# EasyEDA schematic SCH_Volvo CEM-L (50) cracker_2023-01-16.json

## Sheets
1 Sheet_1: TITLE: Volvo CEM cracker (P1 + P2); REV: 1.2; Date: 2021-Jan-9; Sheet: 1/1; Drawn By: vtl; Company: Kitchen office
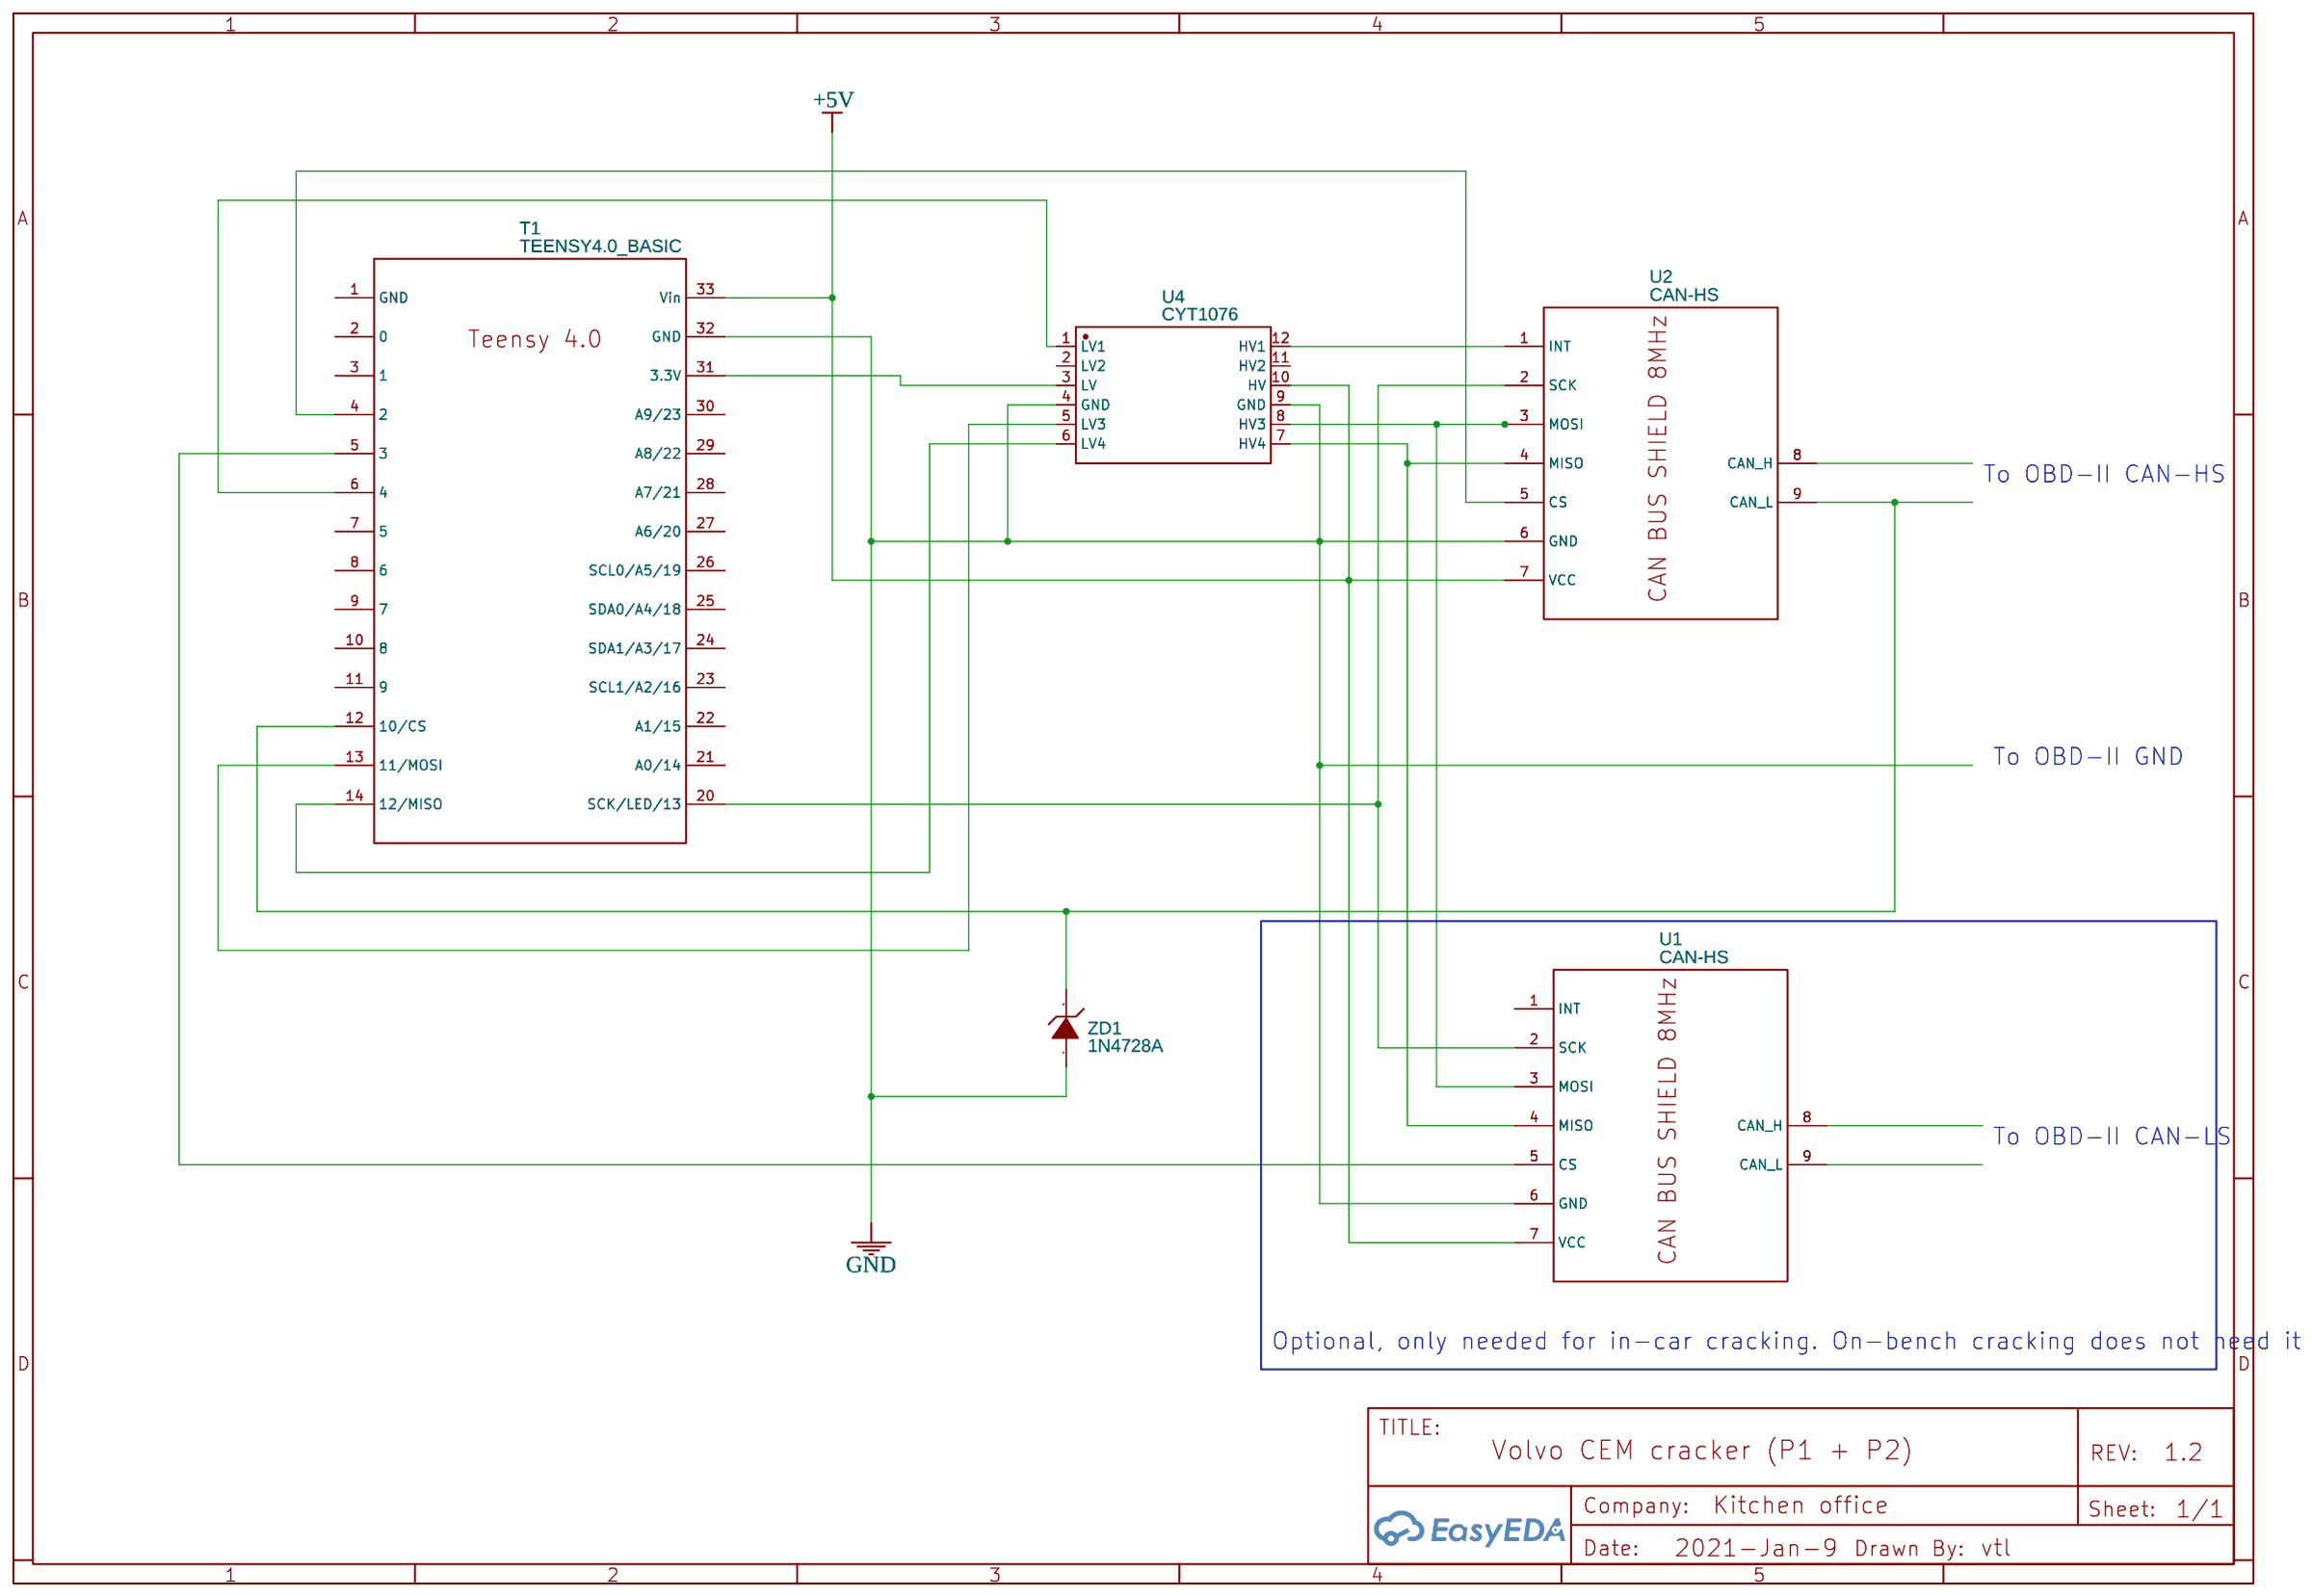
[diagram p0: Sheet_1]
2 Sheet_2: TITLE: Volvo CEM cracker (P1, P2, P3); REV: 2.01; Date: 2022-01-09
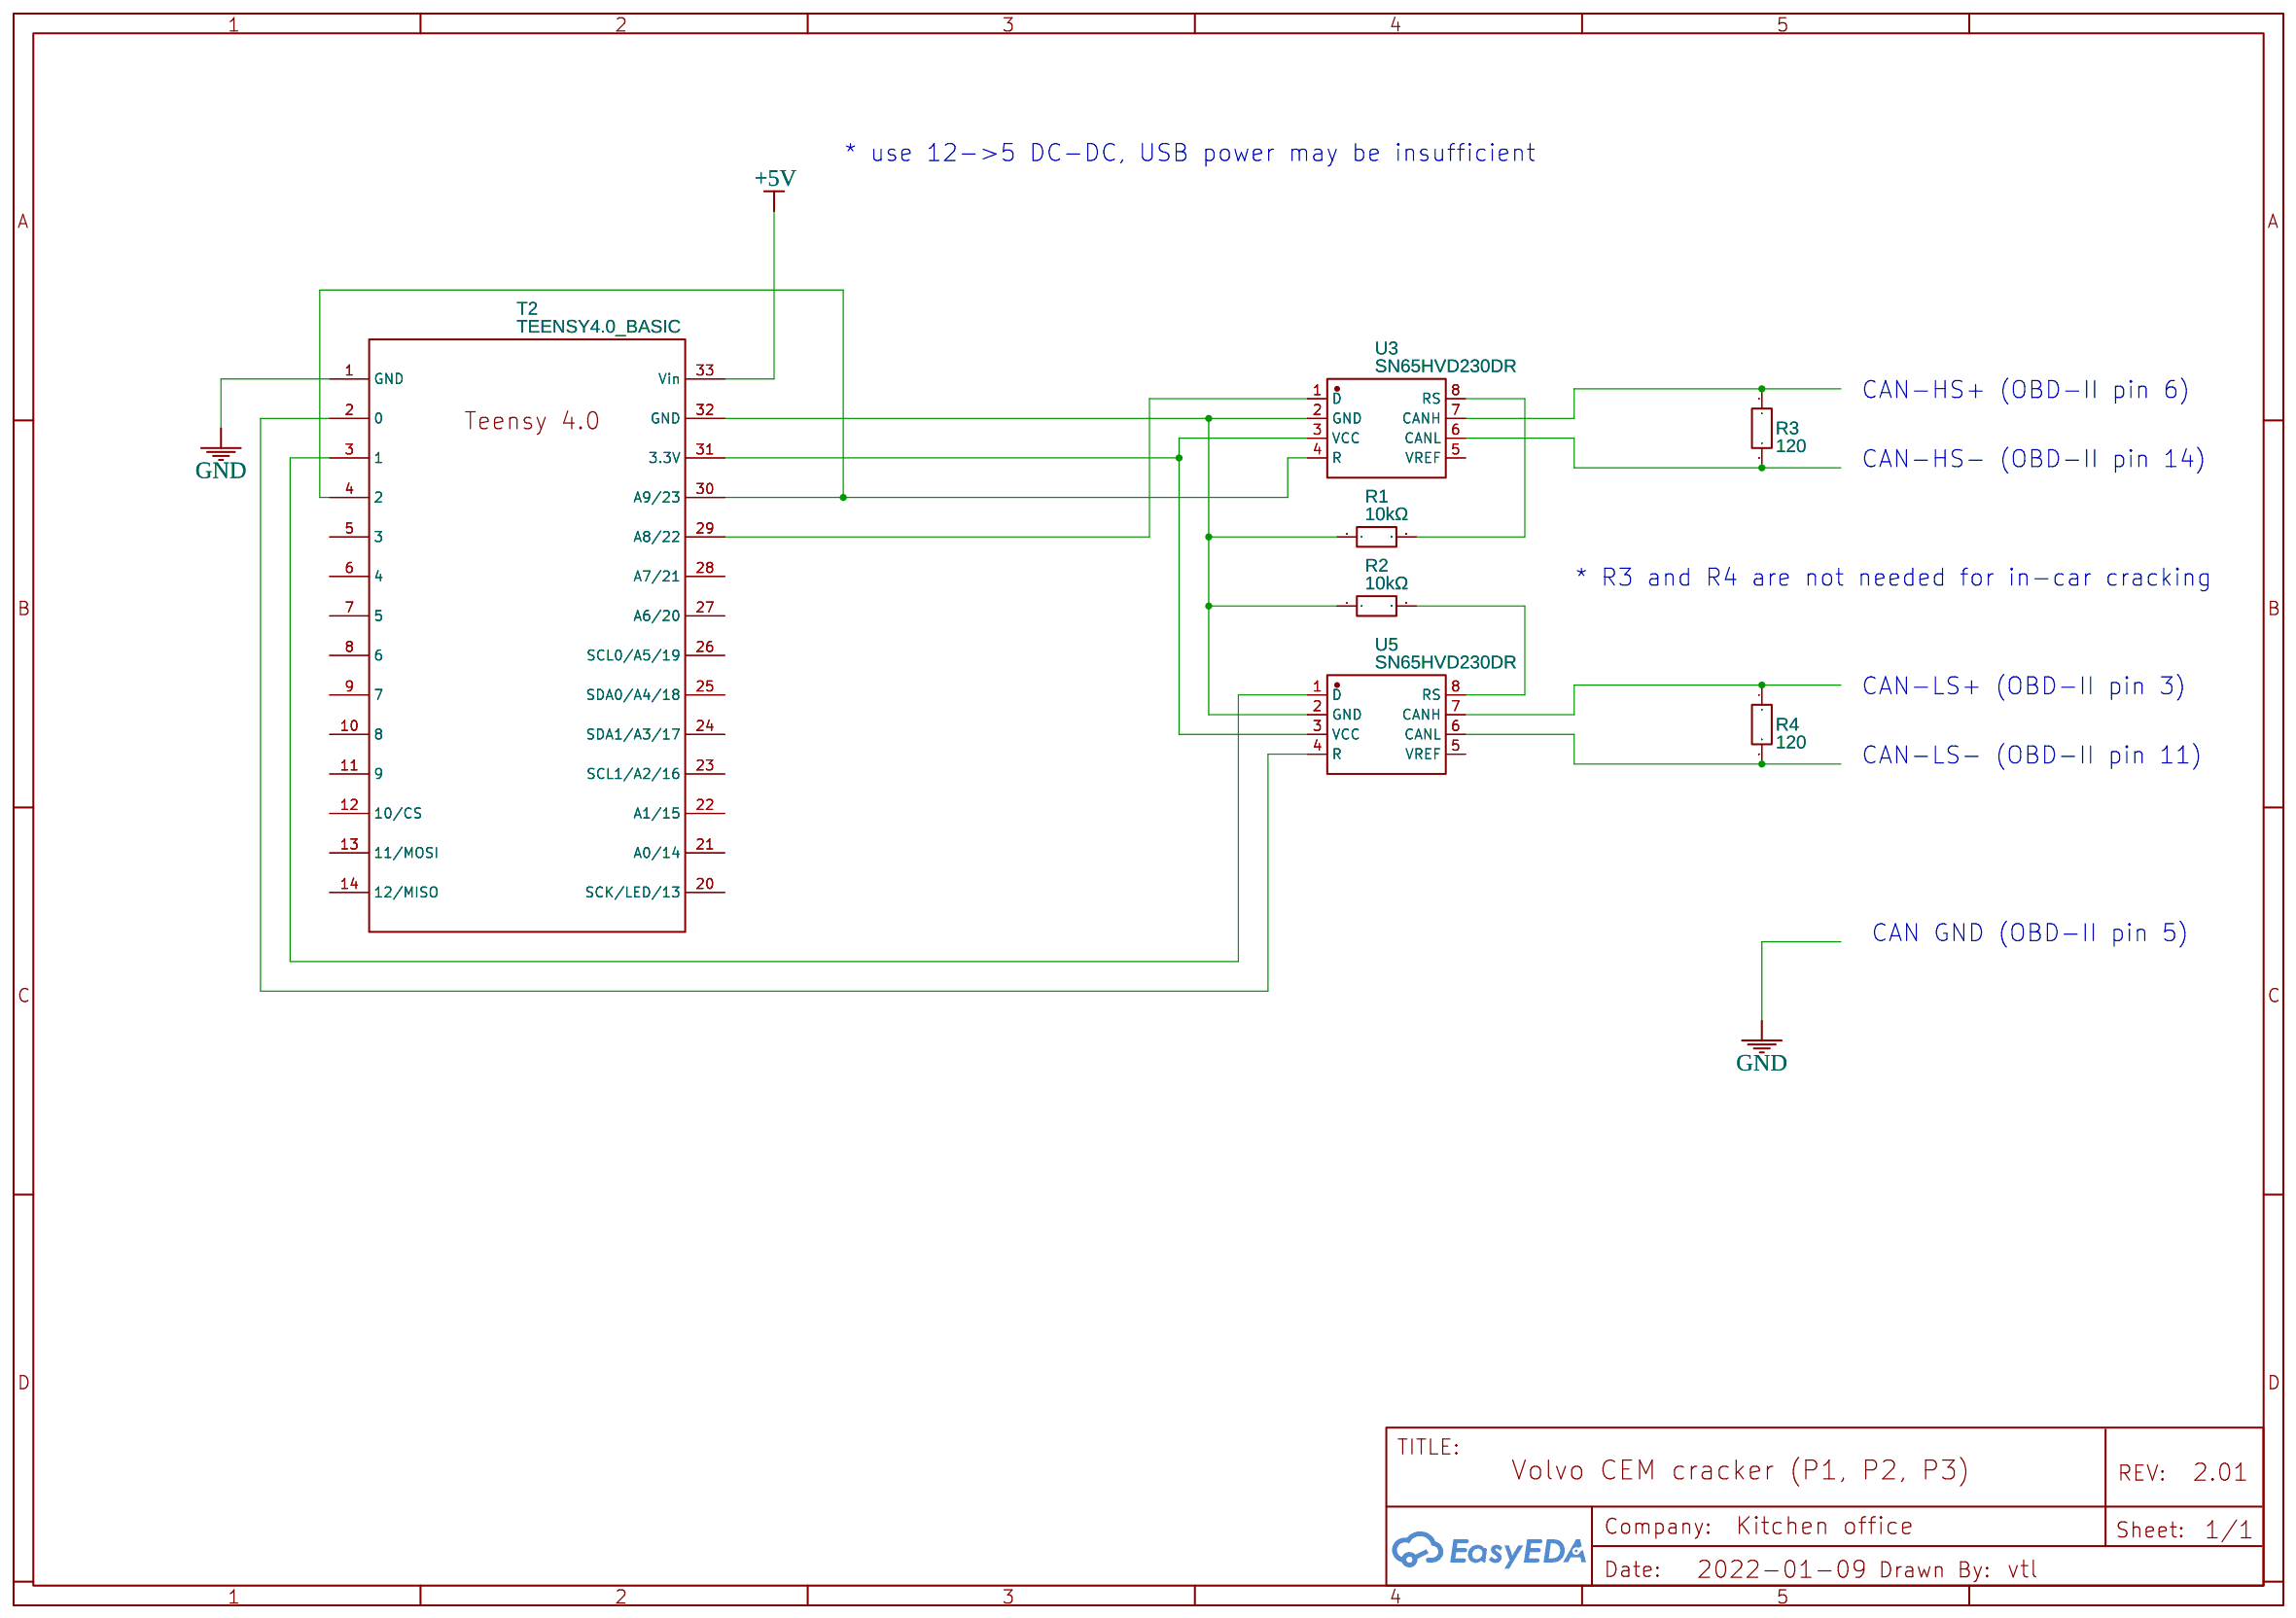
[diagram p1: Sheet_2]

## Parts
sheet Sheet_1
T1  TEENSY4.0_BASIC  [TEENSY4.0_BASIC]
U1  CAN-HS  [CAN_BUS_SHIELD_8MHZ]
U2  CAN-HS  [CAN_BUS_SHIELD_8MHZ]
U4  CYT1076  [CYT1076 FOOT]
ZD1  1N4728A  [DO-41_BD2.8-L4.2-P8.00-D0.7-FD]
sheet Sheet_2
R1  10kΩ  [RES-TH_BD1.8-L3.2-P7.20-D0.4]
R2  10kΩ  [RES-TH_BD1.8-L3.2-P7.20-D0.4]
R3  120  [RES-TH_BD5.0-L15.5-P19.50-D0.7]
R4  120  [RES-TH_BD5.0-L15.5-P19.50-D0.7]
T2  TEENSY4.0_BASIC  [TEENSY4.0_BASIC]
U3  SN65HVD230DR  [SOIC-8_L4.9-W3.9-P1.27-LS6.0-BL]
U5  SN65HVD230DR  [SOIC-8_L4.9-W3.9-P1.27-LS6.0-BL]

## Library data of the parts
T1 T2 = TEENSY4.0_BASIC: Manufacturer: PJRC; Supplier: PJRC; link: https://www.pjrc.com/store/teensy40.html; Contributor: Chris Gscheidle
U1 U2 = -: Contributor: Christer_A
U4 = -: Contributor: krzryz
ZD1 = 1N4728A: Supplier: LCSC; Manufacturer: SEMTECH; image: //image.lceda.cn/szlcsc/C2531.jpg; Supplier Part: C2531; LCSC Assembly: Yes; SMT Type: Extend
R1 R2 = CF1/6W-10KΩ±5%T52: Supplier: LCSC; Supplier Part: C714232; Manufacturer: Huaxing Mechanical-Elec.; Contributor: LCSC
R3 R4 = RD 3WS 120R J T/B A1: Supplier: LCSC; Supplier Part: C433818; Manufacturer: TyoHM; Contributor: LCSC; LCSC Assembly: Yes; SMT Type: Extend; Assembly Type: manualWeld; Paste Type: expand
U3 U5 = SN65HVD230DR: Supplier: LCSC; Manufacturer: TI; image: //image.lceda.cn/szlcsc/C12084.jpg; Supplier Part: C12084; SMT Type: Basic; JLCPCB SMD: Yes; LCSC Assembly: Yes; Assembly Type: smtWeld; Paste Type: base

## Nets
+5V: T1.33(Vin) T2.33(Vin) U1.7(VCC) U2.7(VCC) U4.10(HV)
GND: T1.32(GND) T2.1(GND) U1.6(GND) U2.6(GND) U4.4(GND) U4.9(GND) ZD1.1(A)
Net-(R1-1): R1.1 R2.1 T2.32(GND) U3.2(GND) U5.2(GND)
Net-(R1-2): R1.2 U3.8(RS)
Net-(R2-2): R2.2 U5.8(RS)
Net-(R3-1): R3.1 U3.7(CANH)
Net-(R3-2): R3.2 U3.6(CANL)
Net-(R4-1): R4.1 U5.7(CANH)
Net-(R4-2): R4.2 U5.6(CANL)
Net-(T1-4): T1.4(2) U2.5(CS)
Net-(T1-5): T1.5(3) U1.5(CS)
Net-(T1-6): T1.6(4) U4.1(LV1)
Net-(T1-12): T1.12(10/CS) U2.9(CAN L) ZD1.2(K)
Net-(T1-13): T1.13(11/MOSI) U4.5(LV3)
Net-(T1-14): T1.14(12/MISO) U4.6(LV4)
Net-(T1-20): T1.20(SCK/LED/13) U1.2(SCK) U2.2(SCK)
Net-(T1-31): T1.31(3.3V) U4.3(LV)
Net-(T2-2): T2.2(0) U5.4(R)
Net-(T2-3): T2.3(1) U5.1(D)
Net-(T2-4): T2.4(2) T2.30(A9/23) U3.4(R)
Net-(T2-29): T2.29(A8/22) U3.1(D)
Net-(T2-31): T2.31(3.3V) U3.3(VCC) U5.3(VCC)
Net-(U1-3): U1.3(MOSI) U2.3(MOSI) U4.8(HV3)
Net-(U1-4): U1.4(MISO) U2.4(MISO) U4.7(HV4)
Net-(U2-1): U2.1(INT) U4.12(HV1)

Not connected (* = marked no-connect by the designer): T1 1(GND) 2(0) 3(1) 7(5) 8(6) 9(7) 10(8) 11(9) 21(A0/14) 22(A1/15) 23(SCL1/A2/16) 24(SDA1/A3/17) 25(SDA0/A4/18) 26(SCL0/A5/19) 27(A6/20) 28(A7/21) 29(A8/22) 30(A9/23); T2 5(3) 6(4) 7(5) 8(6) 9(7) 10(8) 11(9) 12(10/CS) 13(11/MOSI) 14(12/MISO) 20(SCK/LED/13) 21(A0/14) 22(A1/15) 23(SCL1/A2/16) 24(SDA1/A3/17) 25(SDA0/A4/18) 26(SCL0/A5/19) 27(A6/20) 28(A7/21); U1 1(INT) 8(CAN H) 9(CAN L); U2 8(CAN H); U3 5(VREF); U4 2(LV2) 11(HV2); U5 5(VREF)

## Notes on the sheets
sheet 1
- To OBD-II CAN-HS
- To OBD-II GND
- To OBD-II CAN-LS
- Optional, only needed for in-car cracking. On-bench cracking does not need it
sheet 2
- * use 12->5 DC-DC, USB power may be insufficient
- CAN-HS+ (OBD-II pin 6)
- CAN-HS- (OBD-II pin 14)
- * R3 and R4 are not needed for in-car cracking
- CAN-LS+ (OBD-II pin 3)
- CAN-LS- (OBD-II pin 11)
- CAN GND (OBD-II pin 5)
